# EAGLE design gui (EAGLE 7.2.0)
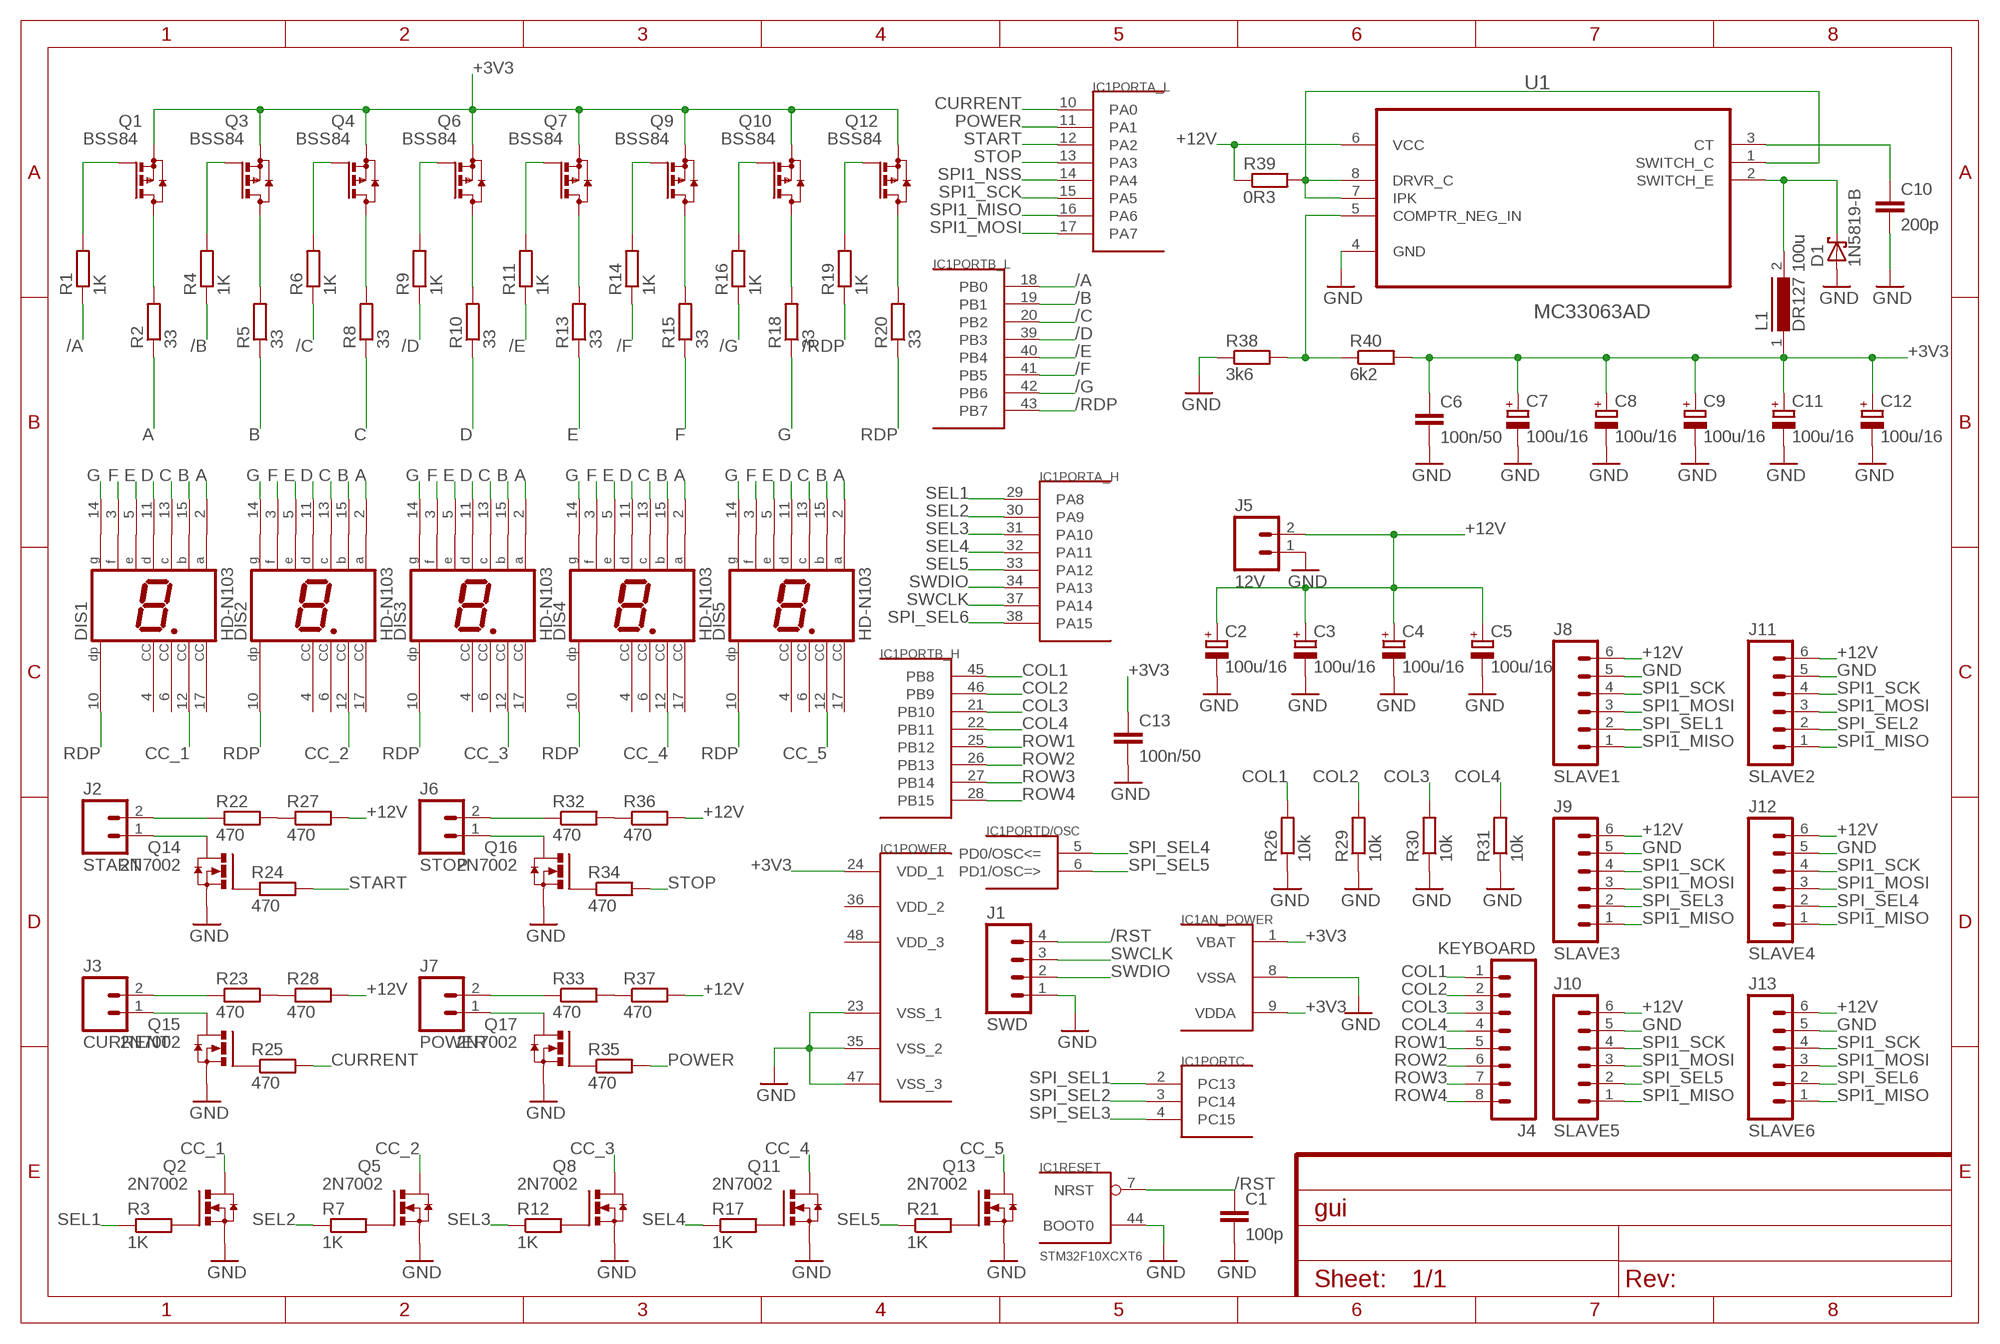
[diagram p0: schematic, sheet 1]
FRAME1 (FRAME-A4L): CNAME: GUI; CREVISION: 100; DESIGNER: Petr Polasek

## Parts
C1  100p  C-EUC0805  [C0805]
C2  100u/16  CPOL-EU153CLV-0605  [153CLV-0605]
C3  100u/16  CPOL-EU153CLV-0605  [153CLV-0605]
C4  100u/16  CPOL-EU153CLV-0605  [153CLV-0605]
C5  100u/16  CPOL-EU153CLV-0605  [153CLV-0605]
C6  100n/50  C-EUC0805  [C0805]
C7  100u/16  CPOL-EU153CLV-0605  [153CLV-0605]
C8  100u/16  CPOL-EU153CLV-0605  [153CLV-0605]
C9  100u/16  CPOL-EU153CLV-0605  [153CLV-0605]
C10  200p  C-EUC0805  [C0805]
C11  100u/16  CPOL-EU153CLV-0605  [153CLV-0605]
C12  100u/16  CPOL-EU153CLV-0605  [153CLV-0605]
C13  100n/50  C-EUC0805  [C0805]
D1  1N5819-B  [DO41-7.6]
DIS1  HD-N103  [HDSP-Q]
DIS2  HD-N103  [HDSP-Q]
DIS3  HD-N103  [HDSP-Q]
DIS4  HD-N103  [HDSP-Q]
DIS5  HD-N103  [HDSP-Q]
IC1  STM32F10XCXT6  [TQFP48]
J1  SWD  M04SMD_STRAIGHT_COMBO  [1X04_SMD_STRAIGHT_COMBO]
J2  START  M02POLAR_LOCK  [MOLEX-1X2_LOCK]
J3  CURRENT  M02POLAR_LOCK  [MOLEX-1X2_LOCK]
J4  KEYBOARD  M08LOCK_LONGPADS  [1X08_LOCK_LONGPADS]
J5  12V  M02POLAR_LOCK  [MOLEX-1X2_LOCK]
J6  STOP  M02POLAR_LOCK  [MOLEX-1X2_LOCK]
J7  POWER  M02POLAR_LOCK  [MOLEX-1X2_LOCK]
J8  SLAVE1  M06POLAR_LOCK  [MOLEX-1X6_LOCK]
J9  SLAVE3  M06POLAR_LOCK  [MOLEX-1X6_LOCK]
J10  SLAVE5  M06POLAR_LOCK  [MOLEX-1X6_LOCK]
J11  SLAVE2  M06POLAR_LOCK  [MOLEX-1X6_LOCK]
J12  SLAVE4  M06POLAR_LOCK  [MOLEX-1X6_LOCK]
J13  SLAVE6  M06POLAR_LOCK  [MOLEX-1X6_LOCK]
L1  DR127 100u  DR127  [DR127]
Q1  BSS84  [SOT23]
Q2  2N7002  [SOT23-BEC]
Q3  BSS84  [SOT23]
Q4  BSS84  [SOT23]
Q5  2N7002  [SOT23-BEC]
Q6  BSS84  [SOT23]
Q7  BSS84  [SOT23]
Q8  2N7002  [SOT23-BEC]
Q9  BSS84  [SOT23]
Q10  BSS84  [SOT23]
Q11  2N7002  [SOT23-BEC]
Q12  BSS84  [SOT23]
Q13  2N7002  [SOT23-BEC]
Q14  2N7002  [SOT23-BEC]
Q15  2N7002  [SOT23-BEC]
Q16  2N7002  [SOT23-BEC]
Q17  2N7002  [SOT23-BEC]
R1  1K  R-EU_R0805  [R0805]
R2  33  R-EU_R0805  [R0805]
R3  1K  R-EU_R0805  [R0805]
R4  1K  R-EU_R0805  [R0805]
R5  33  R-EU_R0805  [R0805]
R6  1K  R-EU_R0805  [R0805]
R7  1K  R-EU_R0805  [R0805]
R8  33  R-EU_R0805  [R0805]
R9  1K  R-EU_R0805  [R0805]
R10  33  R-EU_R0805  [R0805]
R11  1K  R-EU_R0805  [R0805]
R12  1K  R-EU_R0805  [R0805]
R13  33  R-EU_R0805  [R0805]
R14  1K  R-EU_R0805  [R0805]
R15  33  R-EU_R0805  [R0805]
R16  1K  R-EU_R0805  [R0805]
R17  1K  R-EU_R0805  [R0805]
R18  33  R-EU_R0805  [R0805]
R19  1K  R-EU_R0805  [R0805]
R20  33  R-EU_R0805  [R0805]
R21  1K  R-EU_R0805  [R0805]
R22  470  R-EU_R0805  [R0805]
R23  470  R-EU_R0805  [R0805]
R24  470  R-EU_R0805  [R0805]
R25  470  R-EU_R0805  [R0805]
R26  10k  R-EU_R0805  [R0805]
R27  470  R-EU_R0805  [R0805]
R28  470  R-EU_R0805  [R0805]
R29  10k  R-EU_R0805  [R0805]
R30  10k  R-EU_R0805  [R0805]
R31  10k  R-EU_R0805  [R0805]
R32  470  R-EU_R0805  [R0805]
R33  470  R-EU_R0805  [R0805]
R34  470  R-EU_R0805  [R0805]
R35  470  R-EU_R0805  [R0805]
R36  470  R-EU_R0805  [R0805]
R37  470  R-EU_R0805  [R0805]
R38  3k6  R-EU_R0805  [R0805]
R39  0R3  R-EU_R0805  [R0805]
R40  6k2  R-EU_R0805  [R0805]
U1  MC33063AD  [SOIC127P600X175-8N]

## Nets
+3V3: C6.1 C7.+ C8.+ C9.+ C11.+ C12.+ C13.1 IC1.1(AN_POWER:VBAT) IC1.9(AN_POWER:VDDA) IC1.24(POWER:VDD_1) L1.1 Q1.2(S) Q3.2(S) Q4.2(S) Q6.2(S) Q7.2(S) Q9.2(S) Q10.2(S) Q12.2(S) R40.2
+12V: C2.+ C3.+ C4.+ C5.+ J5.2 J8.6 J9.6 J10.6 J11.6 J12.6 J13.6 R27.2 R28.2 R36.2 R37.2 R39.1 U1.6(VCC)
/A: IC1.18(PORTB_L:PB0) R1.1
/B: IC1.19(PORTB_L:PB1) R4.1
/C: IC1.20(PORTB_L:PB2) R6.1
/D: IC1.39(PORTB_L:PB3) R9.1
/E: IC1.40(PORTB_L:PB4) R11.1
/F: IC1.41(PORTB_L:PB5) R14.1
/G: IC1.42(PORTB_L:PB6) R16.1
/RDP: IC1.43(PORTB_L:PB7) R19.1
/RST: C1.1 IC1.7(RESET:NRST) J1.4
A: DIS1.2(A) DIS2.2(A) DIS3.2(A) DIS4.2(A) DIS5.2(A) R2.1
B: DIS1.15(B) DIS2.15(B) DIS3.15(B) DIS4.15(B) DIS5.15(B) R5.1
C: DIS1.13(C) DIS2.13(C) DIS3.13(C) DIS4.13(C) DIS5.13(C) R8.1
CC_1: DIS1.12(CC) Q2.C(D)
CC_2: DIS2.12(CC) Q5.C(D)
CC_3: DIS3.12(CC) Q8.C(D)
CC_4: DIS4.12(CC) Q11.C(D)
CC_5: DIS5.12(CC) Q13.C(D)
COL1: IC1.45(PORTB_H:PB8) J4.1 R26.2
COL2: IC1.46(PORTB_H:PB9) J4.2 R29.2
COL3: IC1.21(PORTB_H:PB10) J4.3 R30.2
COL4: IC1.22(PORTB_H:PB11) J4.4 R31.2
CURRENT: IC1.10(PORTA_L:PA0) R25.2
D: DIS1.11(D) DIS2.11(D) DIS3.11(D) DIS4.11(D) DIS5.11(D) R10.1
E: DIS1.5(E) DIS2.5(E) DIS3.5(E) DIS4.5(E) DIS5.5(E) R13.1
F: DIS1.3(F) DIS2.3(F) DIS3.3(F) DIS4.3(F) DIS5.3(F) R15.1
G: DIS1.14(G) DIS2.14(G) DIS3.14(G) DIS4.14(G) DIS5.14(G) R18.1
GND: C1.2 C2.- C3.- C4.- C5.- C6.2 C7.- C8.- C9.- C10.2 C11.- C12.- C13.2 D1.A IC1.8(AN_POWER:VSSA) IC1.23(POWER:VSS_1) IC1.35(POWER:VSS_2) IC1.44(RESET:BOOT0) IC1.47(POWER:VSS_3) J1.1 J5.1 J8.5 J9.5 J10.5 J11.5 J12.5 J13.5 Q2.E(S) Q5.E(S) Q8.E(S) Q11.E(S) Q13.E(S) Q14.E(S) Q15.E(S) Q16.E(S) Q17.E(S) R26.1 R29.1 R30.1 R31.1 R38.1 U1.4(GND)
N3: Q8.B(G) R12.2
N$1: Q1.3(D) R2.2
N$2: Q3.3(D) R5.2
N$3: Q4.3(D) R8.2
N$4: Q6.3(D) R10.2
N$5: Q7.3(D) R13.2
N$6: Q9.3(D) R15.2
N$7: Q10.3(D) R18.2
N$8: Q12.3(D) R20.2
N$9: Q11.B(G) R17.2
N$10: Q2.B(G) R3.2
N$11: Q5.B(G) R7.2
N$12: Q13.B(G) R21.2
N$13: Q12.1(G) R19.2
N$14: Q10.1(G) R16.2
N$15: Q9.1(G) R14.2
N$16: Q7.1(G) R11.2
N$17: Q6.1(G) R9.2
N$18: Q4.1(G) R6.2
N$19: Q3.1(G) R4.2
N$20: Q1.1(G) R1.2
N$21: J3.1 Q15.C(D)
N$22: J7.1 Q17.C(D)
N$23: J3.2 R23.1
N$24: R23.2 R28.1
N$25: J7.2 R33.1
N$26: R33.2 R37.1
N$27: J2.1 Q14.C(D)
N$28: J2.2 R22.1
N$29: R22.2 R27.1
N$30: J6.1 Q16.C(D)
N$31: J6.2 R32.1
N$32: R32.2 R36.1
N$33: R38.2 R40.1 U1.5(COMPTR_NEG_IN)
N$34: C10.1 U1.3(CT)
N$35: Q14.B(G) R24.1
N$36: R39.2 U1.1(SWITCH_C) U1.7(IPK) U1.8(DRVR_C)
N$37: D1.C L1.2 U1.2(SWITCH_E)
N$38: Q15.B(G) R25.1
N$40: Q16.B(G) R34.1
N$41: Q17.B(G) R35.1
POWER: IC1.11(PORTA_L:PA1) R35.2
RDP: DIS1.10(DP) DIS2.10(DP) DIS3.10(DP) DIS4.10(DP) DIS5.10(DP) R20.1
ROW1: IC1.25(PORTB_H:PB12) J4.5
ROW2: IC1.26(PORTB_H:PB13) J4.6
ROW3: IC1.27(PORTB_H:PB14) J4.7
ROW4: IC1.28(PORTB_H:PB15) J4.8
SEL1: IC1.29(PORTA_H:PA8) R3.1
SEL2: IC1.30(PORTA_H:PA9) R7.1
SEL3: IC1.31(PORTA_H:PA10) R12.1
SEL4: IC1.32(PORTA_H:PA11) R17.1
SEL5: IC1.33(PORTA_H:PA12) R21.1
SPI1_MISO: IC1.16(PORTA_L:PA6) J8.1 J9.1 J10.1 J11.1 J12.1 J13.1
SPI1_MOSI: IC1.17(PORTA_L:PA7) J8.3 J9.3 J10.3 J11.3 J12.3 J13.3
SPI1_NSS: IC1.14(PORTA_L:PA4)
SPI1_SCK: IC1.15(PORTA_L:PA5) J8.4 J9.4 J10.4 J11.4 J12.4 J13.4
SPI_SEL1: IC1.2(PORTC:PC13) J8.2
SPI_SEL2: IC1.3(PORTC:PC14) J11.2
SPI_SEL3: IC1.4(PORTC:PC15) J9.2
SPI_SEL4: IC1.5(PORTD/OSC:PD0/OSC<=) J12.2
SPI_SEL5: IC1.6(PORTD/OSC:PD1/OSC=>) J10.2
SPI_SEL6: IC1.38(PORTA_H:PA15) J13.2
START: IC1.12(PORTA_L:PA2) R24.2
STOP: IC1.13(PORTA_L:PA3) R34.2
SWCLK: IC1.37(PORTA_H:PA14) J1.3
SWDIO: IC1.34(PORTA_H:PA13) J1.2
Unconnected: DIS1.4(CC) DIS1.6(CC) DIS1.17(CC) DIS2.4(CC) DIS2.6(CC) DIS2.17(CC) DIS3.4(CC) DIS3.6(CC) DIS3.17(CC) DIS4.4(CC) DIS4.6(CC) DIS4.17(CC) DIS5.4(CC) DIS5.6(CC) DIS5.17(CC)

## Power pins joined to a net without a drawn wire
VDD_2: IC1.36(POWER:VDD_2)
VDD_3: IC1.48(POWER:VDD_3)

## Library data of the parts
C1 C6 C10 C13 = petr:C-EU: CAPACITOR, European symbol
C2-C5 C7-C9 C11 C12 = petr:CPOL-EU: POLARIZED CAPACITOR, European symbol
D1 = petr:1N581*: 1.0A SCHOTTKY BARRIER RECTIFIER Source: http://www.diodes.com/datasheets/ds23001.pdf
DIS1-DIS5 = display-hp:HD-N103: LED DISPLAY 1-character 7 segment, decimal point right; OC_FARNELL: unknown; OC_NEWARK: unknown
IC1 = stm32:STM32F10XCXT6: ST STM32F101/103 48pin LQFP
J1 = SparkFun-Connectors:M04: Header 4 Standard 4-pin 0.1" header. Use with straight break away headers (SKU : PRT-00116), right angle break away headers (PRT-00553), swiss pins (PRT-00743), machine pins (PRT-00117), and female headers (PRT-00115). Molex polarized connector foot print use with SKU : PRT-08231 with associated crimp pins and housings. 1MM SMD Version SKU: PRT-10208; PROD_ID: CONN-08511; VALUE: 1X04_SMD_STRAIGHT_COMBO
J2 J3 J5-J7 = SparkFun-Connectors:M02: Standard 2-pin 0.1" header. Use with - straight break away headers ( PRT-00116) - right angle break away headers (PRT-00553) - swiss pins (PRT-00743) - machine pins (PRT-00117) - female headers (PRT-00115) Molex polarized connector foot print use with: PRT-08233 with associated crimp pins and housings. 2.54_SCREWTERM for use with PRT-10571. 3.5mm Screw Terminal footprints for PRT-08084 5mm Screw Terminal footprints for use with PRT-08432
J4 = SparkFun-Connectors:M08: Header 8 Standard 8-pin 0.1" header. Use with straight break away headers (SKU : PRT-00116), right angle break away headers (PRT-00553), swiss pins (PRT-00743), machine pins (PRT-00117), and female headers (PRT-00115).
J8-J13 = SparkFun-Connectors:M06: Header 6 Standard 6-pin 0.1" header. Use with straight break away headers (SKU : PRT-00116), right angle break away headers (PRT-00553), swiss pins (PRT-00743), machine pins (PRT-00117), and female headers (PRT-00115). Molex polarized connector foot print use with SKU : PRT-08094 with associated crimp pins and housings. NOTES ON THE VARIANTS LOCK and LOCK_LONGPADS... This footprint was designed to help hold the alignment of a through-hole component (i.e. 6-pin header) while soldering it into place. You may notice that each hole has been shifted either up or down by 0.005 of an inch from it's more standard position (which is a perfectly straight line). This slight alteration caused the pins (the squares in the middle) to touch the edges of the holes. Because they are alternating, it causes a "brace" to hold the component in place. 0.005 has proven to be the perfect amount of "off-center" position when using our standard breakaway headers. Although looks a little odd when you look at the bare footprint, once you have a header in there, the alteration is very hard to notice. Also,if you push a header all the way into place, it is covered up entirely on the bottom side. This idea of altering the position of holes to aid alignment will be further integrated into the Sparkfun Library for other footprints. It can help hold any component with 3 or more connection pins.
L1 = inductors:DR127: High Power Density, High Efficiency, Shielded Inductors Source: coiltronics_dr_series.pdf
Q1 Q3 Q4 Q6 Q7 Q9 Q10 Q12 = petr:BSS84: P-CHANNEL MOS FET
Q2 Q5 Q8 Q11 Q13-Q17 = petr:2N7002
R1-R40 = petr:R-EU_: RESISTOR, European symbol
U1 = Texas Instruments_By_element14_Batch_1:MC33063AD: REGULATORS; MPN: MC33063AD; OC_FARNELL: 1053591; OC_NEWARK: 05M4209; PACKAGE: SOIC-8; SUPPLIER: TI

## Board
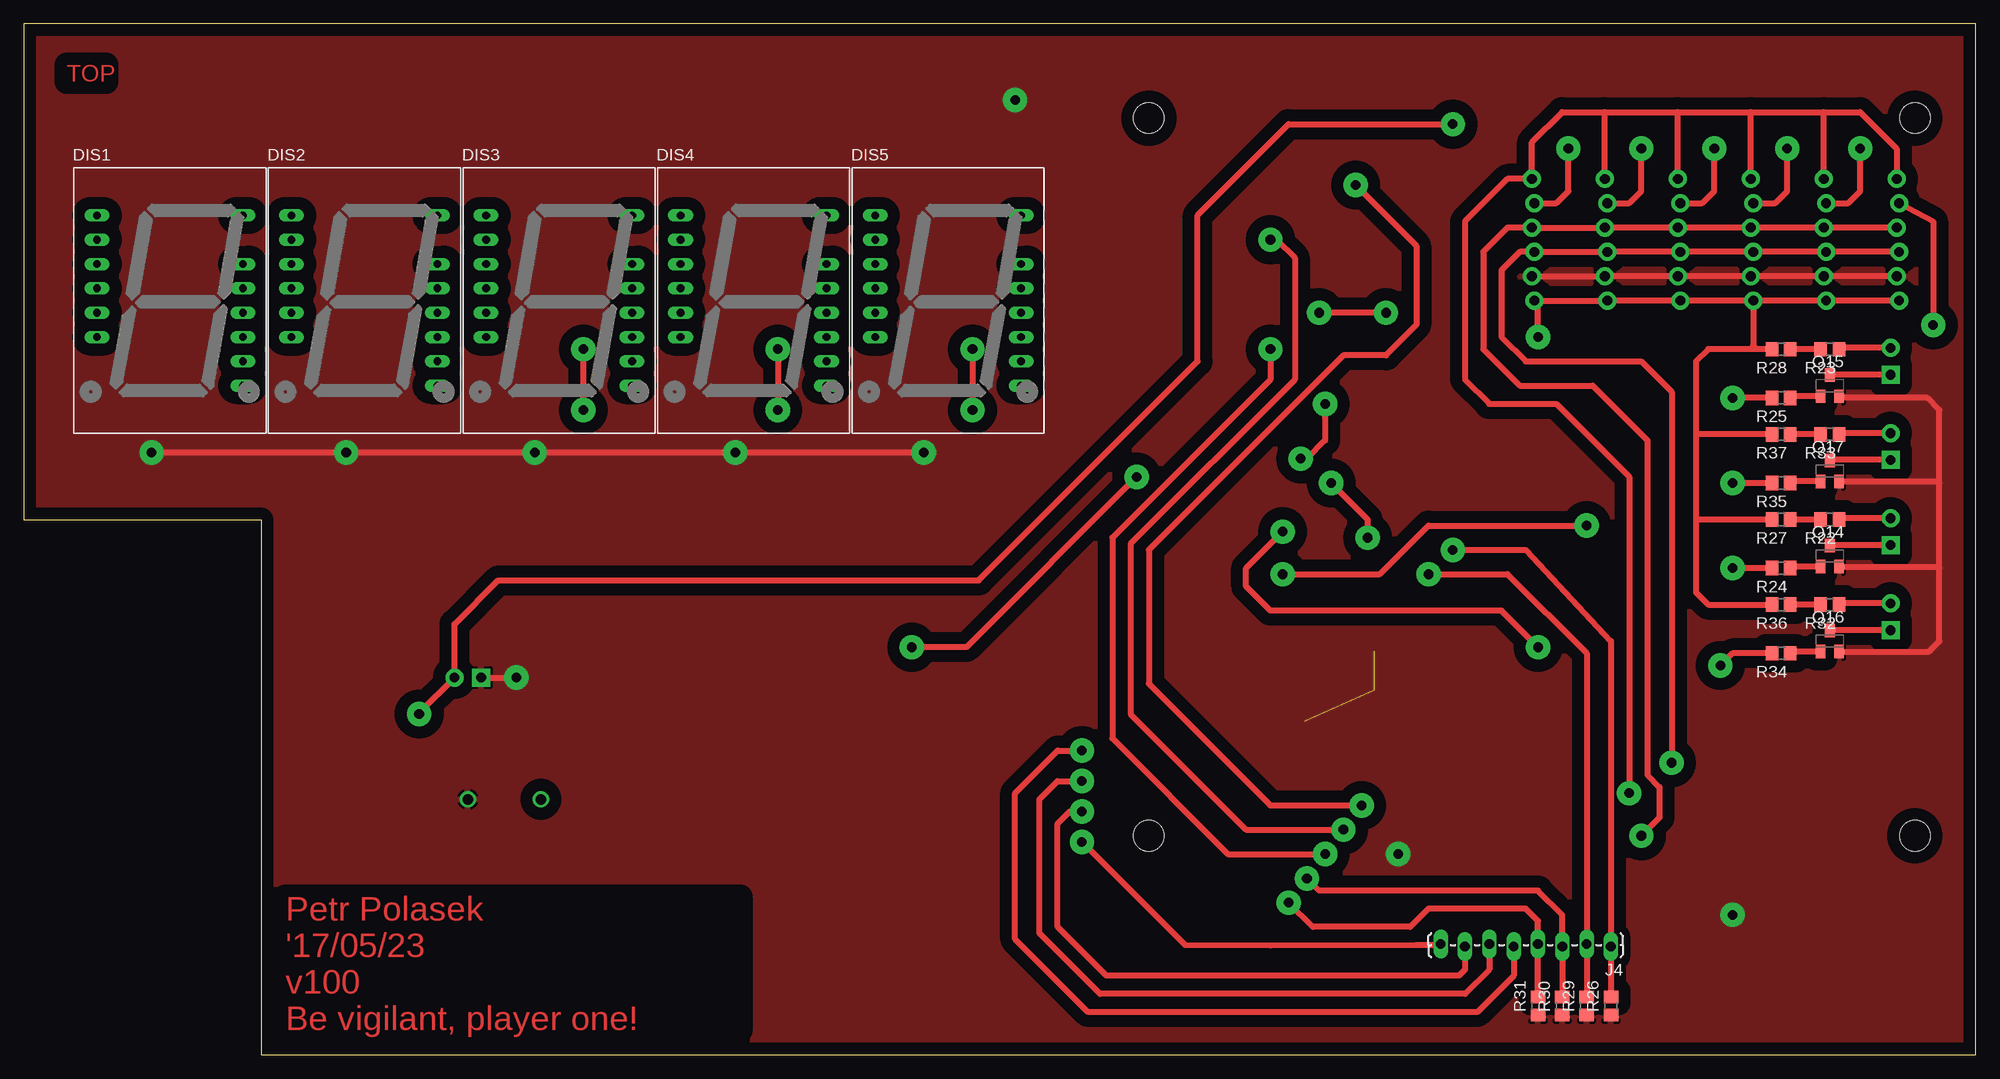
[diagram p1: board, top side]
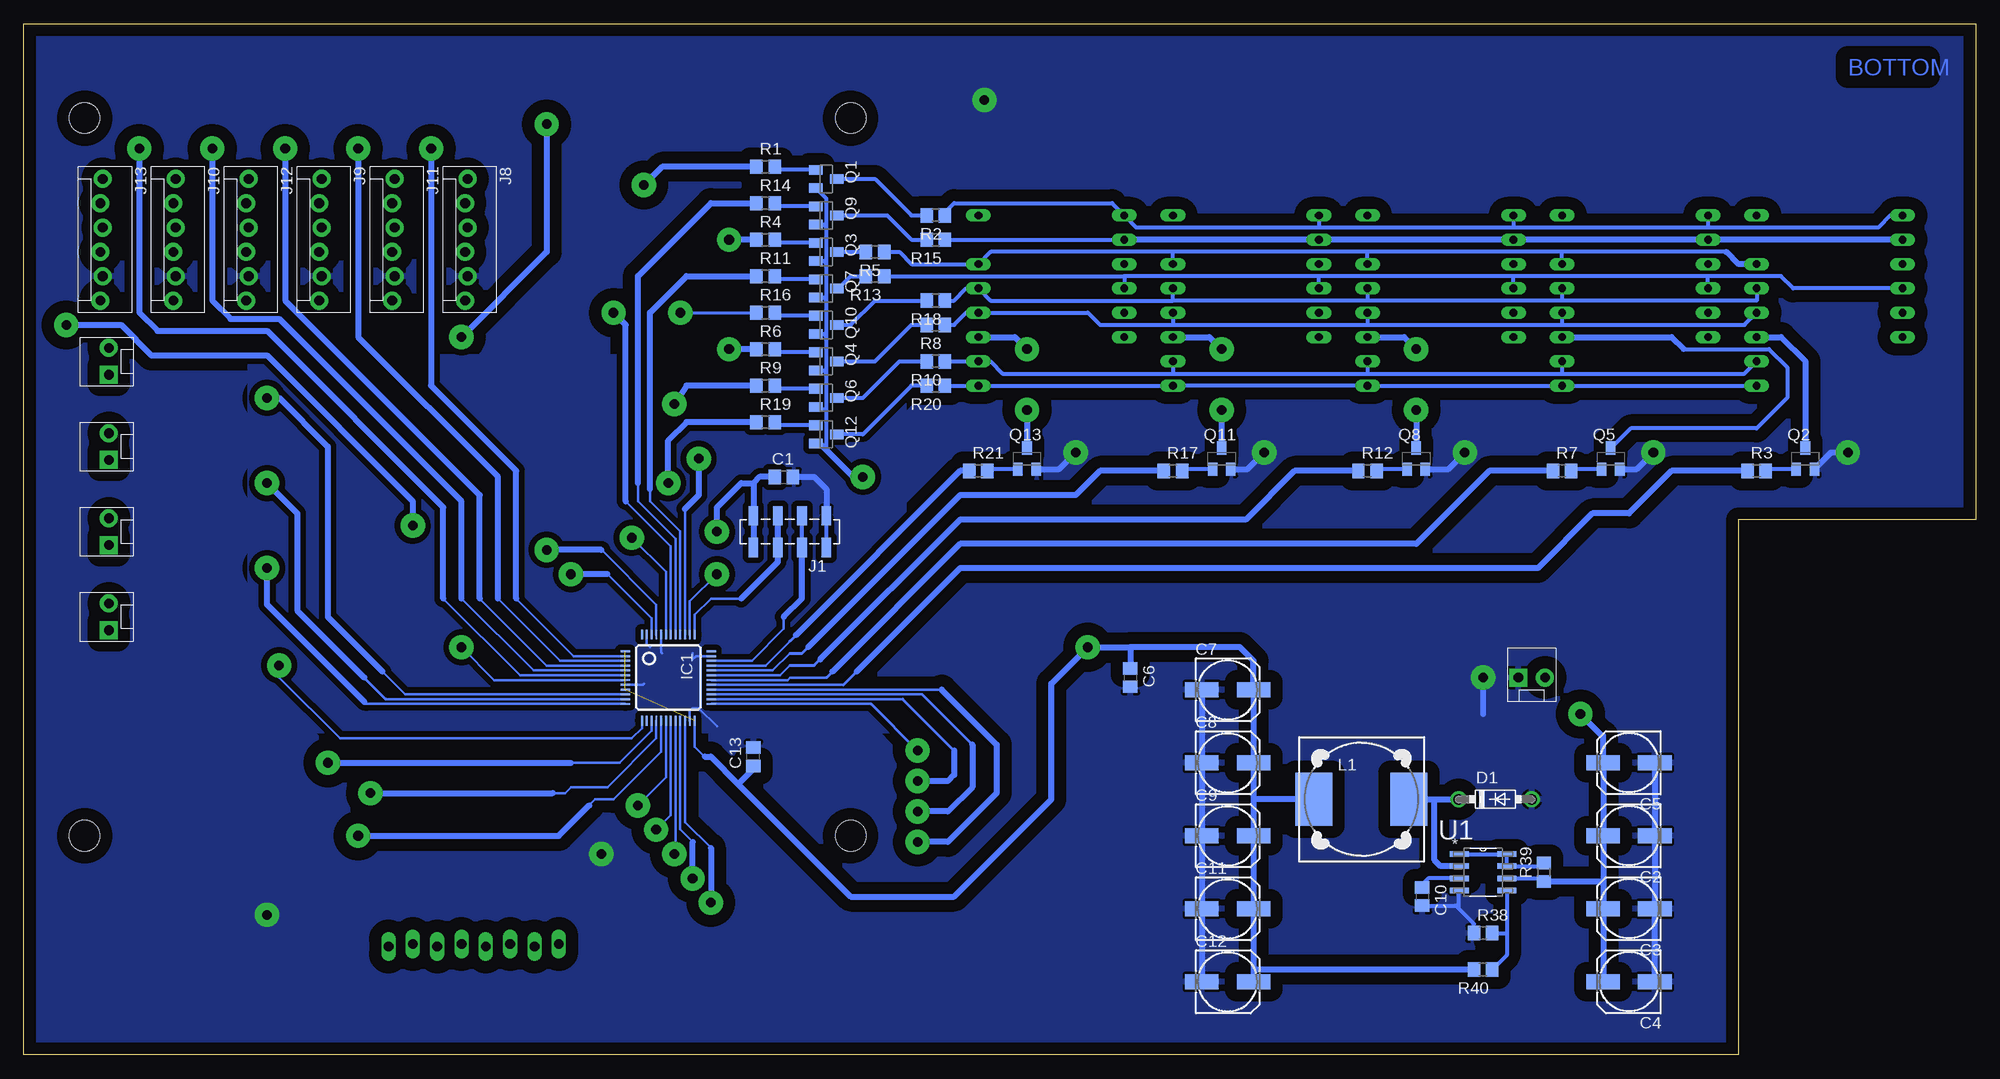
[diagram p2: board, bottom side, seen from below]

Size 203.81 x 107.62 mm. Coordinates in mm from the lower left corner, seen from the top.
Outline: 24.77,0 203.81,0 203.81,107.62 0,107.62 0,55.88 24.77,55.88 24.77,0
Copper layers (1*16): Top 0.035mm / dielectric 1.5mm / Bottom 0.035mm
Design rules "default": minimum track width 10mil, minimum drill 24mil, track to track 8mil, track to pad 8mil, pad to pad 8mil, via to via 8mil, smd to smd 8mil, copper to edge 40mil, drill to drill 8mil, minimum pad ring 10mil, minimum via ring 8mil, stop-mask expansion 4mil, vias tented up to drill 0mil, thermal gap 10mil
Holes 3.2 mm at 117.47,97.79 117.47,22.86 197.49,97.79 197.49,22.86

### Footprints (pad centres in the part's own frame; a part is rotated, then mirrored left to right if it is on the bottom)
C0805 = smd 1.3 x 1.5: 1 -0.95,0; 2 0.95,0
153CLV-0605 = smd 3.5 x 1.6: + 2.7,0; - -2.7,0
DO41-7.6 = drill 1.1 pad 1.7: A 3.81,0; C -3.81,0
HDSP-Q = drill 0.813 long: 2 -7.62,8.89; 3 -7.62,6.35; 4 -7.62,3.81; 5 -7.62,1.27; 6 -7.62,-1.27; 7 -7.62,-3.81; 10 7.62,-8.89; 11 7.62,-6.35; 12 7.62,-3.81; 13 7.62,-1.27; 14 7.62,1.27; 15 7.62,3.81; 17 7.62,8.89
TQFP48 = smd 0.2 x 1: 1 -2.75,-4.5; 2 -2.25,-4.5; 3 -1.75,-4.5; 4 -1.25,-4.5; 5 -0.75,-4.5; 6 -0.25,-4.5; 7 0.25,-4.5; 8 0.75,-4.5; 9 1.25,-4.5; 10 1.75,-4.5; 11 2.25,-4.5; 12 2.75,-4.5; 25 2.75,4.5; 26 2.25,4.5; 27 1.75,4.5; 28 1.25,4.5; 29 0.75,4.5; 30 0.25,4.5; 31 -0.25,4.5; 32 -0.75,4.5; 33 -1.25,4.5; 34 -1.75,4.5; 35 -2.25,4.5; 36 -2.75,4.5 | smd 1 x 0.2: 13 4.5,-2.75; 14 4.5,-2.25; 15 4.5,-1.75; 16 4.5,-1.25; 17 4.5,-0.75; 18 4.5,-0.25; 19 4.5,0.25; 20 4.5,0.75; 21 4.5,1.25; 22 4.5,1.75; 23 4.5,2.25; 24 4.5,2.75; 37 -4.5,2.75; 38 -4.5,2.25; 39 -4.5,1.75; 40 -4.5,1.25; 41 -4.5,0.75; 42 -4.5,0.25; 43 -4.5,-0.25; 44 -4.5,-0.75; 45 -4.5,-1.25; 46 -4.5,-1.75; 47 -4.5,-2.25; 48 -4.5,-2.75
1X04_SMD_STRAIGHT_COMBO = smd 1 x 2: 1 0,-1.65; 1-2 0,1.65; 2 2.54,1.65; 2-2 2.54,-1.65; 3 5.08,-1.65; 3-2 5.08,1.65; 4 7.62,1.65; 4-2 7.62,-1.65
MOLEX-1X2_LOCK = drill 1.016 pad 1.88 square: 1 -0.127,0 | drill 1.016 pad 1.88: 2 2.667,0
1X08_LOCK_LONGPADS = drill 1.016 long: 1 0,0.127; 2 2.54,-0.127; 3 5.08,0.127; 4 7.62,-0.127; 5 10.16,0.127; 6 12.7,-0.127; 7 15.24,0.127; 8 17.78,-0.127
MOLEX-1X6_LOCK = drill 1.016 pad 1.88: 1 0,0; 2 2.54,-0.254; 3 5.08,0; 4 7.62,-0.254; 5 10.16,0; 6 12.7,-0.254
DR127 = smd 3.85 x 5.5: 1 -4.975,0; 2 4.975,0
SOT23 = smd 1 x 1.4: 1 -0.95,-1.1; 2 0.95,-1.1; 3 0,1.1
SOT23-BEC = smd 1 x 1.4: B -0.95,-1.1; C 0,1.1; E 0.95,-1.1
R0805 = smd 1.3 x 1.5: 1 -0.95,0; 2 0.95,0
SOIC127P600X175-8N = smd 1.981 x 0.559: 1 -2.464,1.905; 2 -2.464,0.635; 3 -2.464,-0.635; 4 -2.464,-1.905; 5 2.464,-1.905; 6 2.464,-0.635; 7 2.464,0.635; 8 2.464,1.905

### Placement (x,y rotation side)
C1  124.46,60.33 0 bottom
C2  36.2,22.86 180 bottom
C3  36.2,15.24 180 bottom
C4  36.2,7.62 180 bottom
C5  36.2,30.48 180 bottom
C6  88.27,39.37 270 bottom
C7  78.11,38.1 0 bottom
C8  78.11,30.48 0 bottom
C9  78.11,22.86 0 bottom
C10  57.79,16.51 270 bottom
C11  78.11,15.24 0 bottom
C12  78.11,7.62 0 bottom
C13  127.64,31.11 90 bottom
D1  50.16,26.67 0 bottom
DIS1  15.24,78.74 0 top
DIS2  35.56,78.74 0 top
DIS3  55.88,78.74 0 top
DIS4  76.2,78.74 0 top
DIS5  96.52,78.74 0 top
IC1  136.53,39.37 270 bottom
J1  120.02,54.61 180 bottom
J2  194.94,53.34 90 bottom
J3  194.94,71.12 90 bottom
J4  165.74,11.43 180 top
J5  47.62,39.37 0 bottom
J6  194.94,44.45 90 bottom
J7  194.94,62.23 90 bottom
J8  157.48,91.44 270 bottom
J9  172.72,91.44 270 bottom
J10  187.96,91.44 270 bottom
J11  165.1,91.44 270 bottom
J12  180.34,91.44 270 bottom
J13  195.58,91.44 270 bottom
L1  64.13,26.67 0 bottom
Q1  120.02,91.44 270 bottom
Q2  17.78,62.23 0 bottom
Q3  120.02,83.82 270 bottom
Q4  120.02,72.39 270 bottom
Q5  38.1,62.23 0 bottom
Q6  120.02,68.58 270 bottom
Q7  120.02,80.01 270 bottom
Q8  58.42,62.23 0 bottom
Q9  120.02,87.63 270 bottom
Q10  120.02,76.2 270 bottom
Q11  78.74,62.23 0 bottom
Q12  120.02,64.77 270 bottom
Q13  99.06,62.23 0 bottom
Q14  188.6,52.07 0 top
Q15  188.6,69.85 0 top
Q16  188.6,43.18 0 top
Q17  188.6,60.96 0 top
R1  126.36,92.71 0 bottom
R2  108.58,87.63 180 bottom
R3  22.86,60.96 0 bottom
R4  126.36,85.09 0 bottom
R5  114.94,83.82 180 bottom
R6  126.36,73.66 0 bottom
R7  43.18,60.96 0 bottom
R8  108.58,76.2 180 bottom
R9  126.36,69.85 0 bottom
R10  108.58,72.39 180 bottom
R11  126.36,81.28 0 bottom
R12  63.5,60.96 0 bottom
R13  114.94,81.28 180 bottom
R14  126.36,88.9 0 bottom
R15  108.58,85.09 180 bottom
R16  126.36,77.47 0 bottom
R17  83.82,60.96 0 bottom
R18  108.58,78.74 180 bottom
R19  126.36,66.04 0 bottom
R20  108.58,69.85 180 bottom
R21  104.14,60.96 0 bottom
R22  188.6,55.88 180 top
R23  188.6,73.66 180 top
R24  183.51,50.8 180 top
R25  183.51,68.58 180 top
R26  165.74,5.08 90 top
R27  183.51,55.88 180 top
R28  183.51,73.66 180 top
R29  163.19,5.08 90 top
R30  160.65,5.08 90 top
R31  158.12,5.08 90 top
R32  188.6,46.99 180 top
R33  188.6,64.77 180 top
R34  183.51,41.91 180 top
R35  183.51,59.69 180 top
R36  183.51,46.99 180 top
R37  183.51,64.77 180 top
R38  51.44,12.7 0 bottom
R39  45.09,19.05 90 bottom
R40  51.44,8.89 180 bottom
U1  51.44,19.05 0 bottom

### Tracks (layer width: path | path; a pad name or v marks a point on that pad's centre or on a via)
+3V3  (via drill 1 pad 2.54)  (2 unrouted)
  Top 0.61: v116.2,60.33 98.42,42.55 v92.71,42.55
  Bottom 0.254: IC1.24 133.78,32.17 132.72,31.11
  Bottom 0.406: Q6.2 120.97,67.63 120.02,67.31 | 120.02,67.31 120.02,71.12 | 120.02,71.12 120.02,74.93 | 120.02,74.93 120.02,78.74 | 120.02,78.74 120.02,82.55 | 120.02,82.55 120.02,86.36 | 120.02,86.36 120.02,89.39 Q1.2 | Q9.2 120.33,86.68 120.02,86.36 | Q3.2 120.33,82.87 120.02,82.55 | Q7.2 120.33,79.06 120.02,78.74 | Q10.2 120.33,75.25 120.02,74.93 | Q4.2 120.33,71.44 120.02,71.12 | Q12.2 120.97,63.82 120.58,63.69 120.02,63.5 120.02,67.31
  Bottom 0.61: 75.41,26.67 C8.+ C7.+ 75.41,41.12 76.84,42.55 88.27,42.55 | 75.41,26.67 C9.+ C11.+ 75.41,8.89 | 75.41,8.89 C12.+ | L1.1 75.41,26.67 | R40.2 75.41,8.89 | v116.2,60.33 117.22,60.33 120.58,63.69 | 132.72,31.11 132.08,31.11 129.22,28.26 | 129.22,28.26 117.47,16.51 106.68,16.51 96.52,26.67 96.52,38.73 v92.71,42.55 88.27,42.55 | C13.1 127.64,29.84 129.22,28.26 | 88.27,42.55 C6.1
+12V  (via drill 1 pad 2.54)
  Top 0.61: J12.6 J9.6 J11.6 J8.6 158.12,78.36 v158.12,74.93 | J12.6 J10.6 J13.6 | R28.2 180.98,73.66 | 180.98,73.66 175.89,73.66 174.62,72.39 174.62,64.77 | 174.62,64.77 174.62,55.88 | 174.62,55.88 174.62,48.26 175.89,46.99 R36.2 | R27.2 174.62,55.88 | R37.2 174.62,64.77 | v41.28,35.56 41.28,35.69 J5.2 44.96,44.96 49.53,49.53 99.7,49.53 122.56,72.39 122.56,87.63 132.08,97.16 v149.22,97.16 | J12.6 180.59,74.04 180.98,73.66
  Bottom 0.406: U1.6 45.4,18.41 R39.1
  Bottom 0.61: 38.9,17.78 C2.+ C5.+ 38.9,33.31 39.02,33.31 v41.28,35.56 | 38.9,17.78 C3.+ 38.9,7.78 38.73,7.62 C4.+ | R39.1 39.22,18.1 38.9,17.78 | v149.22,97.16 149.22,83.82 v158.12,74.93
/A  (via drill 1 pad 2.54)
  Top 0.61: v139.06,90.81 145.42,84.45 145.42,76.2 142.24,73.03 137.8,73.03 117.47,52.7 117.47,38.73 130.18,26.04 v139.7,26.04
  Bottom 0.254: IC1.18 136.78,28.96 v139.7,26.04
  Bottom 0.61: R1.1 137.16,92.71 v139.06,90.81
/B  (via drill 1 pad 2.54)
  Top 0.61: v130.18,85.09 130.81,85.09 132.72,83.19 132.72,70.48 115.57,53.34 115.57,35.56 127.64,23.5 v137.8,23.5
  Bottom 0.254: IC1.19 136.28,25.02 v137.8,23.5
  Bottom 0.61: R4.1 v130.18,85.09
/C  (via drill 1 pad 2.54)
  Top 0.61: v130.18,73.66 130.18,70.48 113.67,53.98 113.67,33.02 125.73,20.95 v135.89,20.95
  Bottom 0.254: IC1.20 135.78,21.07
  Bottom 0.305: 135.78,21.07 v135.89,20.95
  Bottom 0.61: R6.1 v130.18,73.66
/D  (via drill 1 pad 2.54)
  Top 0.61: v135.89,67.94 135.89,64.14 133.99,62.23 v133.35,62.23
  Bottom 0.254: IC1.39 134.78,56.99
  Bottom 0.61: R9.1 134.62,69.85 v135.89,67.94 | v133.35,62.23 133.35,58.42 134.78,56.99
/E
  Bottom 0.254: IC1.40 135.28,54.63 138.43,57.78 138.43,59.05
  Bottom 0.61: 138.43,59.05 138.43,77.47 134.62,81.28 R11.1
/F
  Bottom 0.254: IC1.41 135.78,53.86 139.7,57.78 139.7,59.69
  Bottom 0.61: 139.7,59.69 139.7,81.28 132.08,88.9 R14.1
/G  (via drill 1 pad 2.54)
  Top 0.61: v142.24,77.47 v135.25,77.47
  Bottom 0.254: IC1.42 136.28,53.09 140.97,57.78
  Bottom 0.305: v135.25,77.47 R16.1
  Bottom 0.61: 140.97,57.78 140.97,76.2 v142.24,77.47
/RDP  (via drill 1 pad 2.54)
  Top 0.61: v140.33,53.98 140.33,55.88 v136.53,59.69
  Bottom 0.254: IC1.43 136.78,50.41 v140.33,53.98
  Bottom 0.61: R19.1 134.62,66.04 136.53,64.14 v136.53,59.69
/RST  (via drill 1 pad 2.54)
  Top 0.61: v158.12,42.55 154.31,46.35 130.18,46.35 127.64,48.9 127.64,50.8 v131.44,54.61
  Bottom 0.254: IC1.7 154.69,39.12 v158.12,42.55
  Bottom 0.61: C1.1 127,60.33 127.64,59.69 | 127.64,59.69 J1.4 | v131.44,54.61 131.44,57.15 128.91,59.69 127.64,59.69
A
  Bottom 0.406: DIS1.2 8.89,87.63 10.16,86.36 27.94,86.36 | 27.94,86.36 48.26,86.36 | 48.26,86.36 68.58,86.36 | 68.58,86.36 87.63,86.36 DIS5.2 90.17,88.9 106.68,88.9 107.95,87.63 R2.1 | DIS4.2 68.58,86.36 | DIS3.2 48.26,86.36 | DIS2.2 27.94,86.36
B
  Bottom 0.406: 26.04,83.82 43.18,83.82 | 43.18,83.82 63.5,83.82 | 63.5,83.82 83.82,83.82 | 83.82,83.82 102.87,83.82 DIS5.15 111.12,82.55 112.39,83.82 R5.1 | DIS4.15 83.82,83.82 | DIS3.15 63.5,83.82 | DIS2.15 43.18,83.82
  Bottom 0.61: DIS1.15 24.77,82.55 26.04,83.82
C
  Bottom 0.406: R8.1 106.68,76.2 105.41,77.47 DIS5.13 92.71,77.47 91.44,76.2 83.82,76.2 | 83.82,76.2 63.5,76.2 | 63.5,76.2 43.18,76.2 | 43.18,76.2 24.13,76.2 DIS1.13 | DIS2.13 43.18,76.2 | DIS3.13 63.5,76.2 | DIS4.13 83.82,76.2
CC_1
  Bottom 0.61: DIS1.12 20.32,74.93 17.78,72.39 Q2.C
CC_2
  Bottom 0.406: 30.48,73.66 21.59,73.66 19.69,71.75 19.69,68.58 22.86,65.41 36.02,65.41 Q5.C
  Bottom 0.61: DIS2.12 31.75,74.93 30.48,73.66
CC_3  (via drill 1 pad 2.54)
  Top 0.61: v58.42,73.66 v58.42,67.31
  Bottom 0.61: DIS3.12 59.69,74.93 v58.42,73.66 | v58.42,67.31 Q8.C
CC_4  (via drill 1 pad 2.54)
  Top 0.61: v78.74,73.66 v78.74,67.31
  Bottom 0.61: DIS4.12 80.01,74.93 v78.74,73.66 | v78.74,67.31 Q11.C
CC_5  (via drill 1 pad 2.54)
  Top 0.61: v99.06,73.66 v99.06,67.31
  Bottom 0.61: DIS5.12 100.33,74.93 v99.06,73.66 | v99.06,67.31 Q13.C
COL1  (via drill 1 pad 2.54)
  Top 0.61: R26.2 J4.1 165.74,43.18 156.85,52.7 v149.22,52.7
  Bottom 0.254: IC1.45 137.78,46.97 143.51,52.7
  Bottom 0.61: 143.51,52.7 v149.22,52.7
COL2  (via drill 1 pad 2.54)
  Top 0.61: R29.2 J4.2 163.19,41.91 154.94,50.16 v146.69,50.16
  Bottom 0.254: IC1.46 138.28,45.56 142.88,50.16
  Bottom 0.61: 142.88,50.16 v146.69,50.16
COL3  (via drill 1 pad 2.54)
  Top 0.61: R30.2 J4.3 160.65,14.61 158.12,17.14 135.25,17.14 v133.99,18.41
  Bottom 0.254: IC1.21 135.28,23.52 133.99,22.23
  Bottom 0.61: v133.99,18.41 133.99,22.23
COL4  (via drill 1 pad 2.54)
  Top 0.61: R31.2 J4.4 158.12,13.97 156.85,15.24 146.69,15.24 144.78,13.34 134.62,13.34 v132.08,15.88
  Bottom 0.254: IC1.22 134.78,24.29 132.08,21.59
  Bottom 0.61: 132.08,21.59 v132.08,15.88
CURRENT  (via drill 1 pad 2.54)
  Top 0.61: R25.2 v178.44,68.58
  Bottom 0.254: 166.37,40.01 163.99,37.62 IC1.10
  Bottom 0.61: v178.44,68.58 177.17,68.58 172.08,63.5 172.08,45.72 166.37,40.01
D
  Bottom 0.406: R10.1 DIS5.11 102.87,72.39 101.6,71.12 83.82,71.12 | 83.82,71.12 63.5,71.12 | 63.5,71.12 43.18,71.12 | 43.18,71.12 24.13,71.12 DIS1.11 | DIS2.11 43.18,71.12 | DIS3.11 63.5,71.12 | DIS4.11 83.82,71.12
E
  Bottom 0.406: DIS1.5 19.05,80.01 20.32,81.28 27.94,81.28 | 27.94,81.28 48.26,81.28 | 48.26,81.28 68.58,81.28 | 68.58,81.28 88.9,81.28 | 88.9,81.28 DIS5.5 | DIS4.5 68.58,81.28 | DIS3.5 48.26,81.28 | DIS2.5 27.94,81.28 | R13.1 88.9,81.28
F
  Bottom 0.406: R15.1 DIS5.3
  Bottom 0.61: DIS1.3 DIS2.3 DIS3.3 DIS4.3 DIS5.3
G
  Bottom 0.406: R18.1 106.68,78.74 105.41,80.01 DIS5.14 102.87,78.74 83.82,78.74 | 83.82,78.74 DIS4.14 | DIS3.14 63.5,78.74 | 63.5,78.74 83.82,78.74 | DIS2.14 43.18,78.74 | 43.18,78.74 63.5,78.74 | DIS1.14 22.86,78.74 43.18,78.74
GND  (via drill 1 pad 2.54)
  Top 0.61: J8.5 J11.5 J9.5 J12.5 J10.5 J13.5 | Q16.E 198.93,42.08 200.02,43.18 200.02,50.8 | 200.02,50.8 200.02,59.69 | 200.02,59.69 200.02,67.31 198.75,68.58 189.71,68.58 Q15.E | Q17.E 199.86,59.86 200.02,59.69 | Q14.E 199.86,50.97 200.02,50.8 | J5.1 v51.44,39.37 | v93.98,62.87 v74.3,62.87 v53.34,62.87 v33.66,62.87 v13.34,62.87
  Bottom 0.254: IC1.23 134.28,35.91 133.99,36.2 133.35,36.2 131.44,34.29 | IC1.35 133.64,41.62 133.99,41.27 133.99,41.91 | IC1.44 137.28,42.02 137.16,41.91 | IC1.47 138.78,42.89 138.43,42.55 | IC1.8 139.18,38.62 139.06,38.73
  Bottom 0.406: R38.1 52.39,13.65 53.98,15.24 | 53.98,15.24 53.98,17.07 U1.4 | C10.2 54.3,15.56 53.98,15.24
  Bottom 0.61: C5.- C2.- C3.- C4.- | C7.- C8.- C9.- C11.- C12.- | v51.44,39.37 51.44,35.56 | C1.2 121.28,60.33 120.02,59.05 J1.1 | Q13.E 95.72,61.13 v93.98,62.87 | v13.34,62.87 15.1,62.87 Q2.E | Q5.E 35.39,61.13 v33.66,62.87 | Q8.E 55.08,61.13 v53.34,62.87 | Q11.E 76.03,61.13 v74.3,62.87
  other vias: 178.44,14.61 103.5,99.69 143.51,20.95
  pour Top (isolate 1.27): 203.83,107.95 0,107.95 0,55.88 24.77,55.88 24.77,0 203.83,0
  pour Bottom (isolate 0.61): 111.76,73.03 180.34,73.03 180.34,33.66 111.76,33.66
  pour Bottom (isolate 1.27): 203.83,107.95 0,107.95 0,55.88 24.77,55.88 24.77,0 203.83,0
N3
  Bottom 0.406: Q8.B 62.38,61.13 R12.2
N$1
  Bottom 0.406: Q1.3 114.94,91.44 111.12,87.63 R2.2
N$2
  Bottom 0.406: Q3.3 R5.2
N$3
  Bottom 0.406: Q4.3 114.94,72.39 111.12,76.2 R8.2
N$4
  Bottom 0.406: Q6.3 116.2,68.58 112.39,72.39 R10.2
N$5
  Bottom 0.406: Q7.3 118.75,80.01 117.47,81.28 R13.2
N$6
  Bottom 0.406: Q9.3 113.67,87.63 111.12,85.09 R15.2
N$7
  Bottom 0.406: Q10.3 117.47,76.2 114.94,78.74 R18.2
N$8
  Bottom 0.406: R20.2 111.12,69.85 116.2,64.77 Q12.3
N$9
  Bottom 0.406: Q11.B 82.7,61.13 R17.2
N$10
  Bottom 0.406: Q2.B 21.74,61.13 R3.2
N$11
  Bottom 0.406: Q5.B 42.06,61.13 R7.2
N$12
  Bottom 0.406: Q13.B 103.02,61.13 R21.2
N$13
  Bottom 0.406: Q12.1 125.09,65.72 R19.2
N$14
  Bottom 0.406: Q10.1 125.09,77.15 R16.2
N$15
  Bottom 0.406: Q9.1 125.09,88.58 R14.2
N$16
  Bottom 0.406: Q7.1 125.09,80.96 R11.2
N$17
  Bottom 0.406: Q6.1 125.09,69.53 R9.2
N$18
  Bottom 0.406: Q4.1 125.09,73.34 R6.2
N$19
  Bottom 0.406: Q3.1 125.09,84.77 R4.2
N$20
  Bottom 0.406: Q1.1 125.09,92.39 R1.2
N$21
  Top 0.61: J3.1 188.64,70.99 Q15.C
N$22
  Top 0.61: J7.1 188.64,62.1 Q17.C
N$23
  Top 0.61: J3.2 189.67,73.79 R23.1
N$24
  Top 0.61: R23.2 R28.1
N$25
  Top 0.61: J7.2 189.67,64.9 R33.1
N$26
  Top 0.61: R33.2 R37.1
N$27
  Top 0.61: J2.1 188.64,53.21 Q14.C
N$28
  Top 0.61: J2.2 189.67,56.01 R22.1
N$29
  Top 0.61: R22.2 R27.1
N$30
  Top 0.61: J6.1 188.64,44.32 Q16.C
N$31
  Top 0.61: J6.2 189.67,47.12 R32.1
N$32
  Top 0.61: R32.2 R36.1
N$33
  Bottom 0.406: U1.5 48.97,12.7 | 48.97,12.7 48.97,10.4 R40.1 | R38.2 48.97,12.7
N$34
  Bottom 0.406: U1.3 57.15,18.41 57.79,17.78 C10.1
N$35
  Top 0.61: Q14.B 184.63,50.97 R24.1
N$36
  Bottom 0.406: U1.1 U1.8 U1.7 45.4,19.68 R39.2
N$37
  Bottom 0.61: L1.2 56.52,26.67 | 56.52,26.67 D1.C | U1.2 55.88,19.68 56.52,20.32 56.52,26.67
N$38
  Top 0.61: Q15.B 184.63,68.75 R25.1
N$40
  Top 0.61: Q16.B 184.63,42.08 R34.1
N$41
  Top 0.61: Q17.B 184.63,59.86 R35.1
POWER  (via drill 1 pad 2.54)
  Top 0.61: R35.2 v178.44,59.69
  Bottom 0.254: IC1.11 166.02,37.12
  Bottom 0.305: 168.27,39.37 166.02,37.12
  Bottom 0.61: v178.44,59.69 175.26,56.52 175.26,46.35 168.27,39.37
RDP
  Bottom 0.406: DIS1.10 DIS2.10 DIS3.10 DIS4.10 DIS5.10 R20.1
ROW1  (via drill 1 pad 2.54)
  Top 0.305: v110.49,31.75 110.49,31.11
  Top 0.61: J4.5 155.57,8.26 151.76,4.45 111.12,4.45 103.5,12.06 103.5,27.3 107.95,31.75 v110.49,31.75
  Bottom 0.254: IC1.25 115.36,36.62
  Bottom 0.305: 115.36,36.62 v110.49,31.75
ROW2  (via drill 1 pad 2.54)
  Top 0.305: v110.49,28.57 110.49,27.94
  Top 0.61: J4.6 153.04,8.89 150.5,6.35 112.39,6.35 106.05,12.7 106.05,26.67 107.95,28.57 v110.49,28.57
  Bottom 0.254: IC1.26 112.05,37.12
  Bottom 0.305: 112.05,37.12 106.68,31.75
  Bottom 0.61: 106.68,31.75 106.68,29.21 107.31,28.57 v110.49,28.57
ROW3  (via drill 1 pad 2.54)
  Top 0.305: v110.49,25.4 110.49,24.77
  Top 0.61: J4.7 150.5,8.89 149.86,8.26 113.03,8.26 107.95,13.34 107.95,24.13 109.22,25.4 v110.49,25.4
  Bottom 0.254: IC1.27 110.01,37.62
  Bottom 0.305: 110.01,37.62 104.78,32.38
  Bottom 0.61: 104.78,32.38 104.78,27.94 107.31,25.4 v110.49,25.4
ROW4  (via drill 1 pad 2.54)
  Top 0.61: J4.8 147.95,11.43 145.42,11.43 130.21,11.4 121.28,11.43 v110.49,22.23
  Bottom 0.254: IC1.28 107.97,38.12
  Bottom 0.61: 107.97,38.12 102.23,32.38 102.23,27.3 107.31,22.23 v110.49,22.23
SEL1
  Bottom 0.254: IC1.29 118.22,38.62
  Bottom 0.305: 118.22,38.62 116.84,40.01
  Bottom 0.61: R3.1 31.75,60.96 36.2,56.52 40.01,56.52 45.72,50.8 106.05,50.8 116.84,40.01
SEL2
  Bottom 0.254: IC1.30 124.08,39.12 123.83,39.37 120.02,39.37
  Bottom 0.305: 120.02,39.37 119.38,40.01
  Bottom 0.61: R7.1 50.8,60.96 58.42,53.34 106.05,53.34 119.38,40.01
SEL3
  Bottom 0.254: IC1.31 124.84,39.62 123.83,40.64
  Bottom 0.305: 123.83,40.64 121.28,40.64 120.65,41.27
  Bottom 0.61: R12.1 71.12,60.96 76.2,55.88 106.05,55.88 120.65,41.27
SEL4
  Bottom 0.254: IC1.32 125.61,40.12 123.83,41.91
  Bottom 0.305: 123.83,41.91 122.56,41.91 121.92,42.55
  Bottom 0.61: R17.1 91.44,60.96 93.98,58.42 106.05,58.42 121.92,42.55
SEL5
  Bottom 0.254: IC1.33 126.39,40.62 123.83,43.18
  Bottom 0.305: 123.83,43.18 123.19,43.81
  Bottom 0.61: R21.1 106.05,60.96 123.19,43.81
SPI1_MISO  (via drill 1 pad 2.54)
  Top 0.61: 165.1,98.42 160.65,98.42 157.48,95.25 J8.1 154.94,91.44 150.5,87 150.5,70.48 153.04,67.94 160.02,67.94 167.64,60.33 v167.64,27.3 | 165.1,98.42 172.72,98.42 | 172.72,98.42 180.34,98.42 | 180.34,98.42 187.96,98.42 | 187.96,98.42 191.77,98.42 195.58,94.61 J13.1 | J10.1 187.96,98.42 | J12.1 180.34,98.42 | J9.1 172.72,98.42 | J11.1 165.1,98.42
  Bottom 0.254: IC1.16 137.78,33.04 142.88,27.94 146.69,27.94 147.32,27.3 148.59,27.3
  Bottom 0.61: v167.64,27.3 148.59,27.3
SPI1_MOSI  (via drill 1 pad 2.54)
  Top 0.61: J13.3 J10.3 J12.3 J9.3 J11.3 J8.3 154.94,86.36 152.4,83.82 152.4,73.66 156.21,69.85 163.83,69.85 169.55,64.14 169.55,29.21 170.81,27.94 170.81,24.77 v168.91,22.86
  Bottom 0.254: IC1.17 137.28,31.64 142.24,26.67 144.14,26.67 144.78,26.04
  Bottom 0.61: v168.91,22.86 147.95,22.86 144.78,26.04
SPI1_SCK  (via drill 1 pad 2.54)
  Top 0.61: J13.4 J10.4 J12.4 J9.4 J11.4 J8.4 156.21,83.82 154.31,81.92 154.31,74.93 156.85,72.39 168.91,72.39 172.08,69.22 v172.08,30.48
  Bottom 0.254: IC1.15 138.28,33.81 141.61,30.48 146.69,30.48
  Bottom 0.61: v172.08,30.48 146.69,30.48
SPI_SEL1  (via drill 1 pad 2.54)
  Top 0.61: J8.2 160.02,88.9 161.29,90.17 v161.29,94.61
  Bottom 0.254: IC1.2 146.39,41.62 152.4,47.62
  Bottom 0.61: v161.29,94.61 161.29,69.85 152.4,60.96 152.4,47.62
SPI_SEL2  (via drill 1 pad 2.54)
  Top 0.61: J11.2 167.64,88.9 168.91,90.17 v168.91,94.61
  Bottom 0.254: IC1.3 147.8,41.12 154.31,47.62
  Bottom 0.61: v168.91,94.61 168.91,74.93 154.31,60.33 154.31,47.62
SPI_SEL3  (via drill 1 pad 2.54)
  Top 0.61: J9.2 175.26,88.9 176.53,90.17 v176.53,94.61
  Bottom 0.254: IC1.4 149.2,40.62 156.21,47.62
  Bottom 0.61: v176.53,94.61 176.53,78.74 156.21,58.42 156.21,47.62
SPI_SEL4  (via drill 1 pad 2.54)
  Top 0.61: J12.2 182.88,88.9 184.15,90.17 v184.15,94.61
  Bottom 0.254: IC1.5 150.61,40.12 158.12,47.62
  Bottom 0.61: v184.15,94.61 184.15,78.74 182.25,76.83 177.17,76.83 158.12,57.78 158.12,47.62
SPI_SEL5  (via drill 1 pad 2.54)
  Top 0.61: J10.2 190.5,88.9 191.77,90.17 v191.77,94.61
  Bottom 0.254: IC1.6 152.01,39.62 160.02,47.62
  Bottom 0.61: v191.77,94.61 191.77,77.47 189.87,75.56 178.44,75.56 160.02,57.15 160.02,47.62
SPI_SEL6  (via drill 1 pad 2.54)
  Top 0.61: J13.2 199.39,87 v199.39,76.2 | v131.44,50.16 141.61,50.16 146.69,55.24 v163.19,55.24
  Bottom 0.254: IC1.38 134.28,47.34 v131.44,50.16
  Bottom 0.61: v199.39,76.2 193.68,76.2 190.5,73.03 178.44,73.03 163.19,57.78 v163.19,55.24
START  (via drill 1 pad 2.54)
  Top 0.61: R24.2 v178.44,50.8
  Bottom 0.254: IC1.12 168.06,36.62 168.27,36.83
  Bottom 0.61: 168.27,36.83 178.44,46.99 v178.44,50.8
STOP  (via drill 1 pad 2.54)
  Top 0.61: R34.2 178.44,41.91 v177.17,40.64
  Bottom 0.254: IC1.13 139.28,34.08 140.33,33.02 170.81,33.02 177.17,39.37 v177.17,40.64
SWCLK
  Bottom 0.254: 128.91,47.62 132.08,47.62 133.78,45.93 IC1.37
  Bottom 0.61: J1.3 125.09,51.44 128.91,47.62
SWDIO
  Bottom 0.254: IC1.34 127.79,41.12 124.46,44.45 124.46,45.72
  Bottom 0.61: 124.46,45.72 122.56,47.62 J1.2

### Text on the board
Top: TOP | Petr Polasek / '17/05/23 / v100 / Be vigilant, player one!
Bottom: BOTTOM